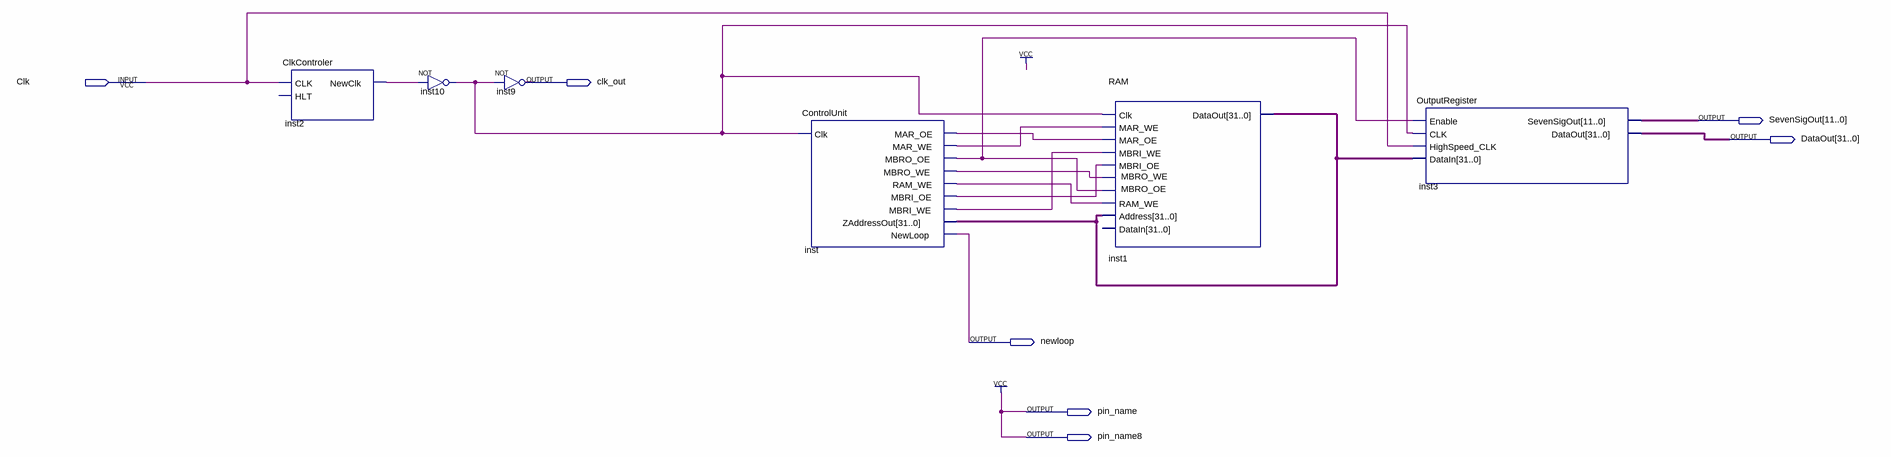
[diagram p0: schematic sheet]
// Quartus schematic FullRam.bdf as structural Verilog: 6 symbols, 7 pins
module FullRam (
  input  Clk,
  output clk_out,
  output [11:0] SevenSigOut,
  output [31:0] DataOut,
  output newloop,
  output pin_name,
  output pin_name8
);

  wire inst2_newclk, inst10_out, inst_mar_oe, inst_mar_we, inst_mbri_oe, inst_mbri_we, inst_mbro_oe,
       inst_mbro_we, inst_ram_we;
  wire [31:0] inst_zaddressout;

  ClkControler inst2 (.CLK(Clk), .NewClk(inst2_newclk));  // open: HLT
  not inst10 (inst10_out, inst2_newclk);
  not inst9 (clk_out, inst10_out);
  ControlUnit inst (
    .Clk(inst10_out), .MAR_OE(inst_mar_oe), .MAR_WE(inst_mar_we), .MBRO_OE(inst_mbro_oe),
    .MBRO_WE(inst_mbro_we), .RAM_WE(inst_ram_we), .MBRI_OE(inst_mbri_oe), .MBRI_WE(inst_mbri_we),
    .ZAddressOut(inst_zaddressout), .NewLoop(newloop));
  RAM inst1 (
    .MBRO_WE(inst_mbro_we), .MBRO_OE(inst_mbro_oe), .MAR_WE(inst_mar_we), .MAR_OE(inst_mar_oe),
    .Clk(inst10_out), .MBRI_WE(inst_mbri_we), .RAM_WE(inst_ram_we), .MBRI_OE(inst_mbri_oe),
    .Address(inst_zaddressout), .DataOut(inst_zaddressout));  // open: DataIn
  OutputRegister inst3 (
    .Enable(inst_mbro_oe), .CLK(inst10_out), .HighSpeed_CLK(Clk), .DataIn(inst_zaddressout),
    .SevenSigOut(SevenSigOut), .DataOut(DataOut));

  assign pin_name = 1'b1;
  assign pin_name8 = 1'b1;
endmodule
